# Altium schematic sheet Principal.SchDoc
size A4; Author: Thomas Kreppel; CompanyName: Universidad de Santiago de Chile; Address1: Avenida Ecuador Nº 3519; Address2: Estación Central, Santiago; Address3: Chile; DocumentNumber: 1; SheetNumber: 1; SheetTotal: 10
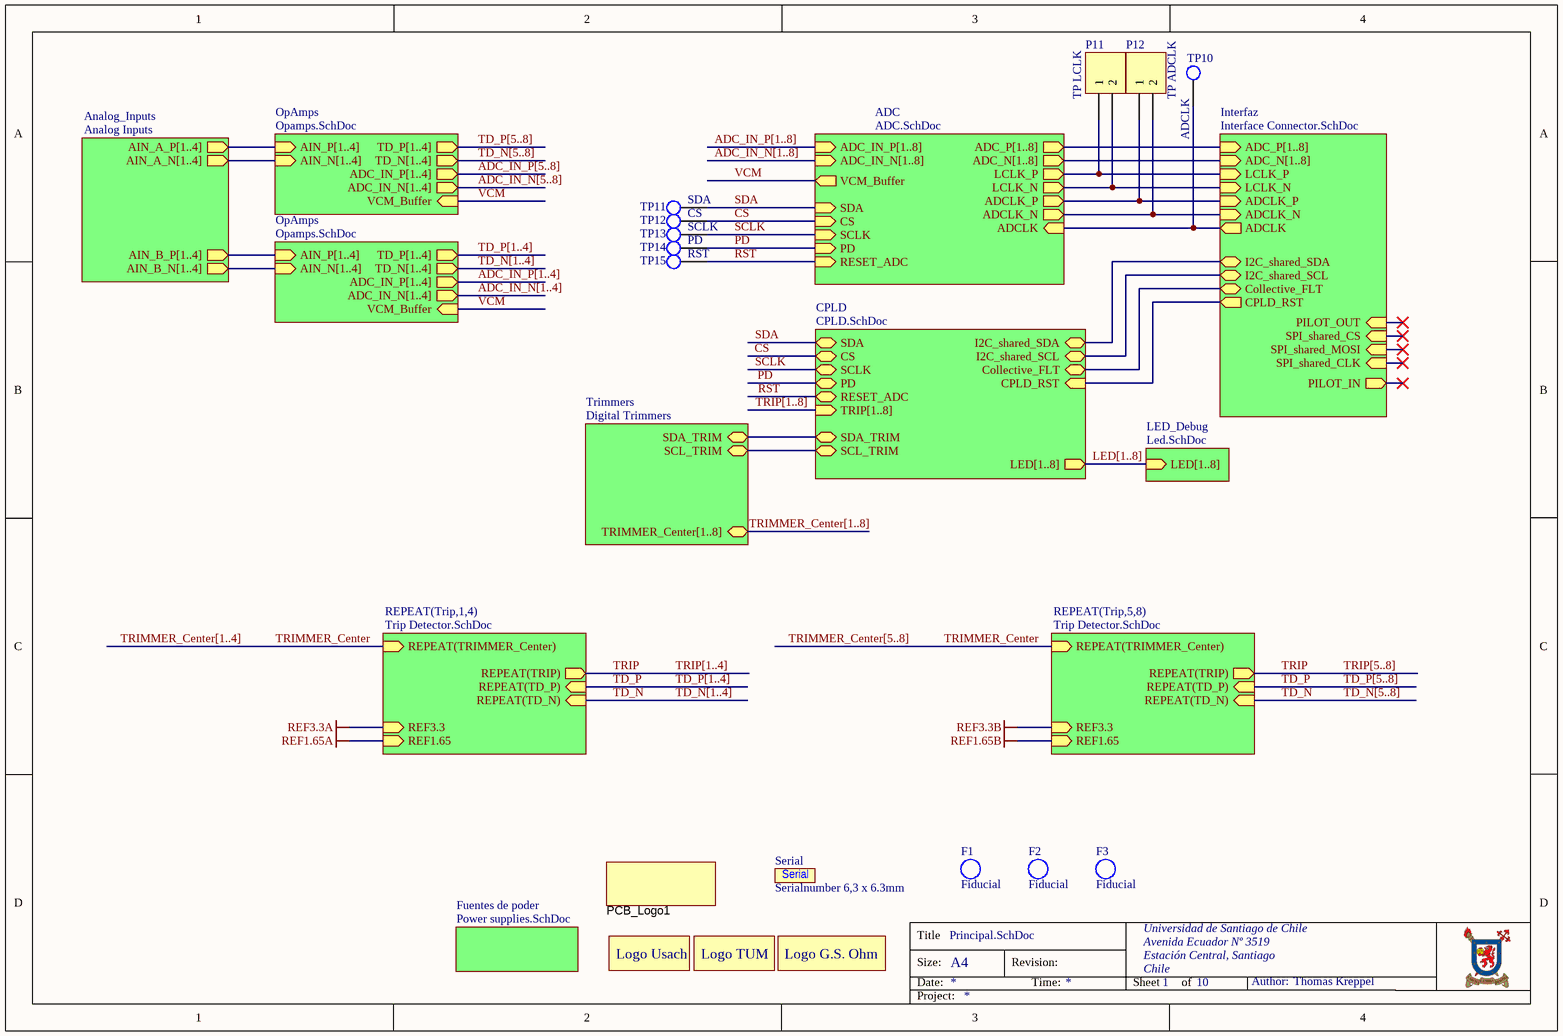
[diagram p0: Principal.SchDoc]

## Parts
F1  Fiducial  [Fiducial_1.7mm]  (no BOM)
F2  Fiducial  [Fiducial_1.7mm]  (no BOM)
F3  Fiducial  [Fiducial_1.7mm]  (no BOM)
Logo1  LOGO USACH  [Logo Usach]  (value not drawn)  (no BOM)
Logo2  LOGO TUM  [Logo TUM]  (value not drawn)  (no BOM)
Logo3  LOGO G.S. Ohm  [Logo G.S.Ohm University]  (value not drawn)  (no BOM)
P11  TP LCLK  [HDR1X2]  (no BOM)
P12  TP ADCLK  [HDR1X2]  (no BOM)
PCB_Logo1  ESD Susceptible  [ESD_Overlay_Medium]  (value not drawn)  (no BOM)
Serial  Serialnumber 6,3 x 6.3mm  [Serial_6.3x6.3mm]  (no BOM)
TP10  ADCLK  [TP_1.6mm]  (no BOM)
TP11  SDA  [TP_1.6mm]  (no BOM)
TP12  CS  [TP_1.6mm]  (no BOM)
TP13  SCLK  [TP_1.6mm]  (no BOM)
TP14  PD  [TP_1.6mm]  (no BOM)
TP15  RST  [TP_1.6mm]  (no BOM)

## Sub-sheets
ADC = ADC.SchDoc: ADCLK_P (out), LCLK_P (out), LCLK_N (out), ADCLK_N (out), ADCLK (in), SDA (in), SCLK (in), CS (in), PD (in), RESET_ADC (in), ADC_P[1..8] (out), ADC_N[1..8] (out), VCM_Buffer (out), ADC_IN_N[1..8] (in), ADC_IN_P[1..8] (in)
Analog_Inputs = Analog Inputs: AIN_B_P[1..4] (out), AIN_B_N[1..4] (out), AIN_A_P[1..4] (out), AIN_A_N[1..4] (out)
CPLD = CPLD.SchDoc: SDA_TRIM (bidir), SCL_TRIM (bidir), TRIP[1..8] (in), LED[1..8] (out), SDA (bidir), SCLK (bidir), CS (bidir), PD (bidir), RESET_ADC (bidir), Collective_FLT (bidir), I2C_shared_SDA (bidir), I2C_shared_SCL (bidir), CPLD_RST (in)
Fuentes de poder = Power supplies.SchDoc: no entries
Interfaz = Interface Connector.SchDoc: ADCLK_P (in), LCLK_P (in), LCLK_N (in), ADCLK_N (in), ADCLK (out), ADC_P[1..8] (in), ADC_N[1..8] (in), Collective_FLT (bidir), I2C_shared_SDA (bidir), I2C_shared_SCL (bidir), SPI_shared_CS (in), SPI_shared_MOSI (in), PILOT_OUT (in), PILOT_IN (out), SPI_shared_CLK (in), CPLD_RST (out)
LED_Debug = Led.SchDoc: LED[1..8] (in)
OpAmps = Opamps.SchDoc: ADC_IN_P[1..4] (out), TD_P[1..4] (out), AIN_P[1..4] (in), AIN_N[1..4] (in), ADC_IN_N[1..4] (out), TD_N[1..4] (out), VCM_Buffer (in)
OpAmps = Opamps.SchDoc: TD_P[1..4] (out), TD_N[1..4] (out), VCM_Buffer (in), AIN_N[1..4] (in), ADC_IN_N[1..4] (out), AIN_P[1..4] (in), ADC_IN_P[1..4] (out)
REPEAT(Trip,1,4) = Trip Detector.SchDoc: REPEAT(TRIMMER_Center) (in), REPEAT(TRIP) (out), REPEAT(TD_P) (in), REPEAT(TD_N) (in), REF3.3 (in), REF1.65 (in)
REPEAT(Trip,5,8) = Trip Detector.SchDoc: REPEAT(TRIMMER_Center) (in), REPEAT(TRIP) (out), REPEAT(TD_P) (in), REPEAT(TD_N) (in), REF3.3 (in), REF1.65 (in)
Trimmers = Digital Trimmers: SDA_TRIM (bidir), SCL_TRIM (bidir), TRIMMER_Center[1..8] (bidir)

## Nets
REF1.65A: sheet REPEAT(Trip,1,4)/REF1.65
REF1.65B: sheet REPEAT(Trip,5,8)/REF1.65
REF3.3A: sheet REPEAT(Trip,1,4)/REF3.3
REF3.3B: sheet REPEAT(Trip,5,8)/REF3.3
CS: TP12.1 ; sheet ADC/CS, sheet CPLD/CS
PD: TP14.1 ; sheet ADC/PD, sheet CPLD/PD
RST: TP15.1 ; sheet ADC/RESET_ADC, sheet CPLD/RESET_ADC
SCLK: TP13.1 ; sheet ADC/SCLK, sheet CPLD/SCLK
SDA: TP11.1 ; sheet ADC/SDA, sheet CPLD/SDA
TD_N: sheet REPEAT(Trip,1,4)/REPEAT(TD_N), sheet REPEAT(Trip,5,8)/REPEAT(TD_N)
TD_P: sheet REPEAT(Trip,1,4)/REPEAT(TD_P), sheet REPEAT(Trip,5,8)/REPEAT(TD_P)
TRIMMER_Center: sheet REPEAT(Trip,1,4)/REPEAT(TRIMMER_Center), sheet REPEAT(Trip,5,8)/REPEAT(TRIMMER_Center)
TRIP: sheet REPEAT(Trip,1,4)/REPEAT(TRIP), sheet REPEAT(Trip,5,8)/REPEAT(TRIP)
VCM: sheet ADC/VCM_Buffer, sheet OpAmps/VCM_Buffer, sheet OpAmps/VCM_Buffer
NetP11_1: P11.1 ; sheet ADC/LCLK_P, sheet Interfaz/LCLK_P
NetP11_2: P11.2 ; sheet ADC/LCLK_N, sheet Interfaz/LCLK_N
NetP12_1: P12.1 ; sheet ADC/ADCLK_P, sheet Interfaz/ADCLK_P
NetP12_2: P12.2 ; sheet ADC/ADCLK_N, sheet Interfaz/ADCLK_N
NetTP10_1: TP10.1 ; sheet ADC/ADCLK, sheet Interfaz/ADCLK
(unnamed): sheet Interfaz/Collective_FLT, sheet CPLD/Collective_FLT
(unnamed): sheet Interfaz/I2C_shared_SDA, sheet CPLD/I2C_shared_SDA
(unnamed): sheet Interfaz/I2C_shared_SCL, sheet CPLD/I2C_shared_SCL
(unnamed): sheet Interfaz/CPLD_RST, sheet CPLD/CPLD_RST
(unnamed): sheet Trimmers/SDA_TRIM, sheet CPLD/SDA_TRIM
(unnamed): sheet Trimmers/SCL_TRIM, sheet CPLD/SCL_TRIM

## Buses and harness runs
bus ADC_IN_N[1..4] = sheet OpAmps/ADC_IN_N[1..4]
bus ADC_IN_N[1..8] = sheet ADC/ADC_IN_N[1..8]
bus ADC_IN_N[5..8] = sheet OpAmps/ADC_IN_N[1..4]
bus ADC_IN_P[1..4] = sheet OpAmps/ADC_IN_P[1..4]
bus ADC_IN_P[1..8] = sheet ADC/ADC_IN_P[1..8]
bus ADC_IN_P[5..8] = sheet OpAmps/ADC_IN_P[1..4]
bus LED[1..8] = sheet CPLD/LED[1..8] = sheet LED_Debug/LED[1..8]
bus sheet ADC/ADC_N[1..8] = sheet Interfaz/ADC_N[1..8]
bus sheet ADC/ADC_P[1..8] = sheet Interfaz/ADC_P[1..8]
bus sheet Analog_Inputs/AIN_A_N[1..4] = sheet OpAmps/AIN_N[1..4]
bus sheet Analog_Inputs/AIN_A_P[1..4] = sheet OpAmps/AIN_P[1..4]
bus sheet Analog_Inputs/AIN_B_N[1..4] = sheet OpAmps/AIN_N[1..4]
bus sheet Analog_Inputs/AIN_B_P[1..4] = sheet OpAmps/AIN_P[1..4]
bus TD_N[1..4]
bus TD_N[1..4] = sheet OpAmps/TD_N[1..4]
bus TD_N[5..8]
bus TD_N[5..8] = sheet OpAmps/TD_N[1..4]
bus TD_P[1..4]
bus TD_P[1..4] = sheet OpAmps/TD_P[1..4]
bus TD_P[5..8]
bus TD_P[5..8] = sheet OpAmps/TD_P[1..4]
bus TRIMMER_Center[1..4]
bus TRIMMER_Center[1..8] = sheet Trimmers/TRIMMER_Center[1..8]
bus TRIMMER_Center[5..8]
bus TRIP[1..4]
bus TRIP[1..8] = sheet CPLD/TRIP[1..8]
bus TRIP[5..8]

## Notes on the sheet
- Title
- Size:
- Date:
- A4
- Revision:
- Time:
- Sheet
- of
- Author:
- Project:
- (in symbol LOGO G.S. Ohm) Logo G.S. Ohm
- (in symbol LOGO TUM) Logo TUM
- (in symbol LOGO USACH) Logo Usach

## Library data of the parts
F1-F3 = Fiducial: Fiducial for Assembler
P11 P12 = Header 2: Header, 2-Pin; LatestRevisionDate: 17-Jul-2002; LatestRevisionNote: Re-released for DXP Platform.; Publisher: Altium Limited
PCB_Logo1 = LOGO_ESD_Susceptible: ESD Susceptible Symbol; Created: 2018_11_25_AGeiger; Value: ESD Susceptible
Serial = SerialNumber: Created: 2018_09_18_AGeiger; Value: Serialnumber 6,3 x 6.3mm
TP10-TP15 = TP: 1.6mm Test Point Keystone; MPN: 5006; Created: 2020_04_Kreppel; MF: Keystone; Supplier 1: Digikey; Supplier Part Number 1: 36-5006-ND
Logo1 = LOGO USACH: Supplier 2: Mouser
Logo2 = LOGO TUM: Supplier 2: Mouser
Logo3 = LOGO G.S. Ohm: Supplier 2: Mouser